# Altium project eTraceConcrete_V1_1.PrjPcb (part 3 of 7)

## Sheet ATSAMD21G18A.SchDoc
size A2
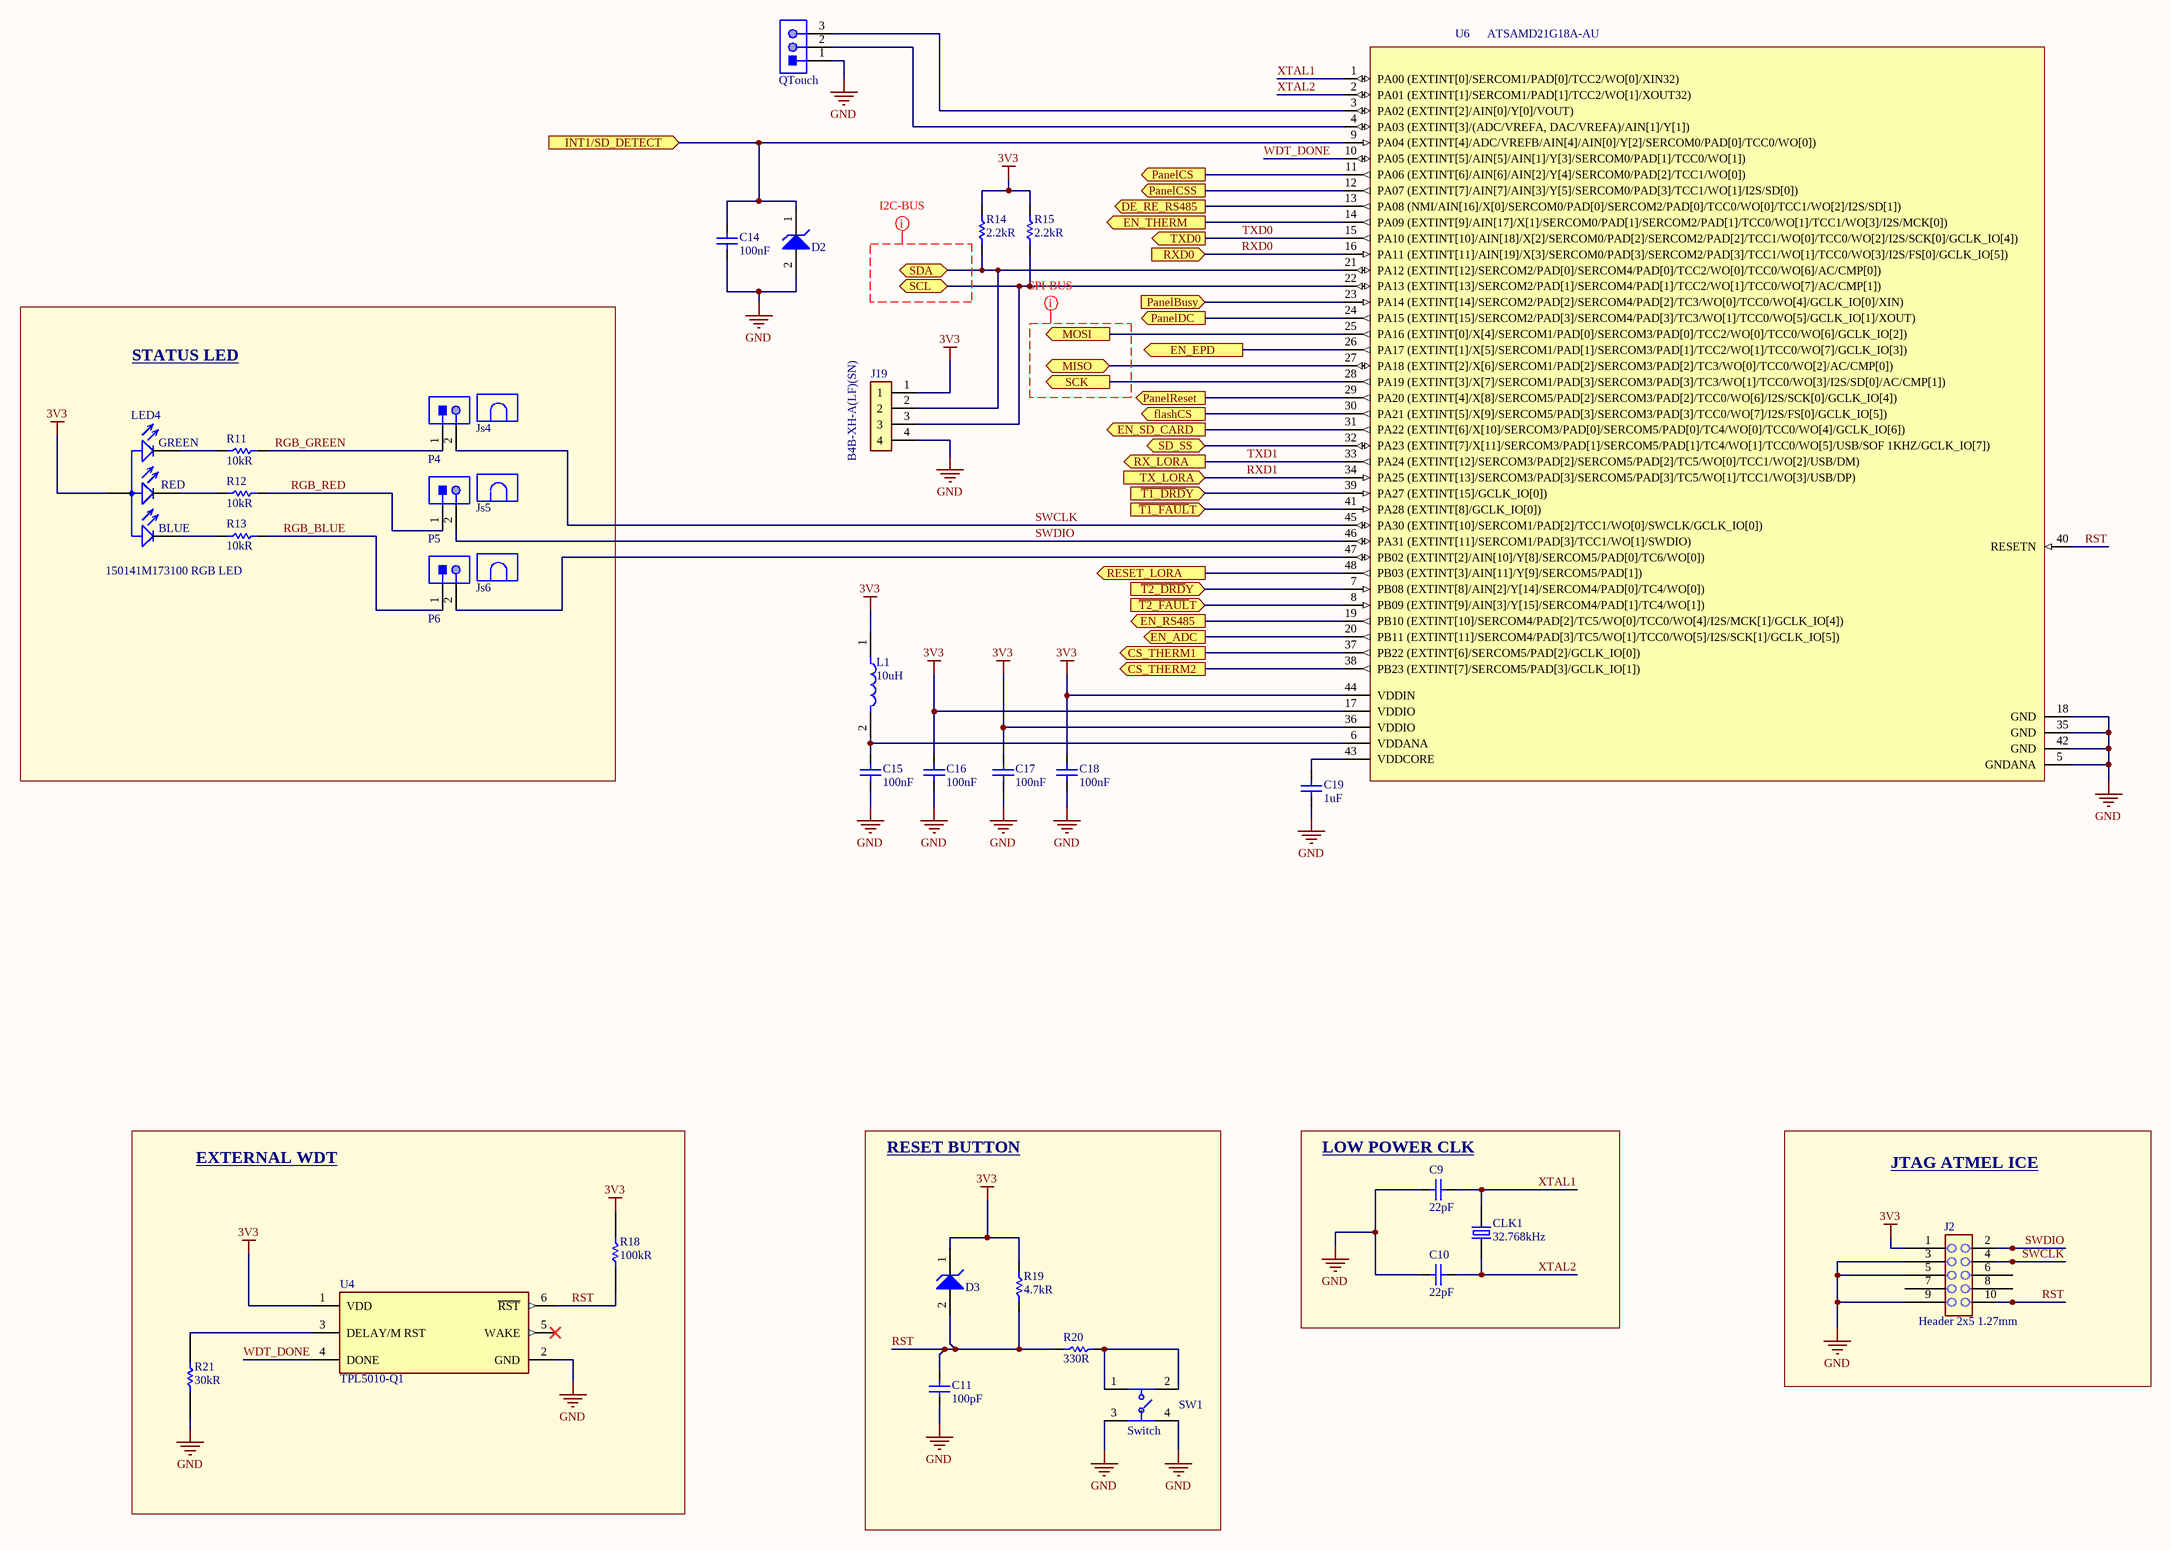
[diagram p3: ATSAMD21G18A.SchDoc]

### Parts
C9  22pF  [Cap 0805 (2012 Metric)]
C10  22pF  [Cap 0805 (2012 Metric)]
C11  100pF  [Cap 0805 (2012 Metric)]
C14  100nF  [Cap 0805 (2012 Metric)]
C15  100nF  [Cap 0805 (2012 Metric)]
C16  100nF  [Cap 0805 (2012 Metric)]
C17  100nF  [Cap 0805 (2012 Metric)]
C18  100nF  [Cap 0805 (2012 Metric)]
C19  1uF  [Cap 0805 (2012 Metric)]
CLK1  Frequency: 32.768kHz  [ECS-327-12.5-13X]  (hidden comment: ECS-327-12.5-13X)
D2  Diode  [Diode SOD123]  (value not drawn)
D3  Diode  [Diode SOD123]  (value not drawn)
J2  Header 2x5 1.27mm  [HEADER_2X5_1-27mm_NO_CONNECTOR]
J19  B4B-XH-A(LF)(SN)  [B4B-XH-A(LF)(SN)]
Js4  Jumper (2x1)  [Header JMP 2x1]  (value not drawn)
Js5  Jumper (2x1)  [Header JMP 2x1]  (value not drawn)
Js6  Jumper (2x1)  [Header JMP 2x1]  (value not drawn)
L1  10uH  [Ind 0805 (2012 METRIC)]
LED4  150141M173100 RGB LED  [150141M173100]
P4  Header 2x1  [Header 2x1]  (value not drawn)
P5  Header 2x1  [Header 2x1]  (value not drawn)
P6  Header 2x1  [Header 2x1]  (value not drawn)
QTouch  Header 3x1  [HEADER 3X1]  (value not drawn)
R11  10kR  [Res 0805 (2012 Metric)]
R12  10kR  [Res 0805 (2012 Metric)]
R13  10kR  [Res 0805 (2012 Metric)]
R14  2.2kR  [Res 0805 (2012 Metric)]
R15  2.2kR  [Res 0805 (2012 Metric)]
R18  100kR  [Res 0805 (2012 Metric)]
R19  4.7kR  [Res 0805 (2012 Metric)]
R20  330R  [Res 0805 (2012 Metric)]
R21  30kR  [Res 0805 (2012 Metric)]
SW1  Switch  [Sw 4 (4.5 X 4.5mm)]
U4  TPL5010-Q1  [TPL5010-Q1_IPCA]
U6  ATSAMD21G18A-AU-ND  [ATSAMD21G18A-AU-ND]  (value not drawn)

### Blocks framed on the sheet
STATUS LED: Js4-Js6 LED4 P4-P6 R11-R13
EXTERNAL WDT: R18 R21 U4
RESET BUTTON: C11 D3 R19 R20 SW1
LOW POWER CLK: C9 C10 CLK1
JTAG ATMEL ICE: J2

### Ports
CS_THERM1 (out), CS_THERM2 (out), DE_RE_RS485 (out), EN_ADC (out), EN_EPD (out), EN_RS485 (out), EN_SD_CARD (out), EN_THERM (out), flashCS (out), INT1/SD_DETECT (in), MISO (bidir), MOSI (out), PanelBusy (in), PanelCS (out), PanelCSS (out), PanelDC (out), PanelReset (out), RESET_LORA (out), RX_LORA (out), RXD0 (in), SCK (out), SCL (bidir), SD_SS (bidir), SDA (bidir), TX_LORA (in), TXD0 (out), ~{T1_DRD}Y (in), ~{T1_FAUL}T (in), ~{T2_DRD}Y (in), ~{T2_FAUL}T (in)

### Nets
3V3: C16.1 C17.1 C18.1 D3.1(K) J2.1 J19.1 L1.1 LED4.1(A) R14.1 R15.1 R18.1 R19.1 U4.1(VDD) U6.17(VDDIO) U6.36(VDDIO) U6.44(VDDIN)
GND: C9.1 C10.1 C11.2 C14.2 C15.2 C16.2 C17.2 C18.2 C19.2 D2.2(A) J2.3 J2.5 J2.9 J19.4 QTouch.1 R21.2 SW1.3 SW1.4 U4.2(GND) U6.5(GNDANA) U6.18(GND) U6.35(GND) U6.42(GND)  [project net BS]
~{T1_DRD}Y: U6.39(PA27_(EXTINT[15]/GCLK_IO[0])) ; port ~{T1_DRD}Y
~{T1_FAUL}T: U6.41(PA28_(EXTINT[8]/GCLK_IO[0])) ; port ~{T1_FAUL}T
~{T2_DRD}Y: U6.7(PB08_(EXTINT[8]/AIN[2]/Y[14]/SERCOM4/PAD[0]/TC4/WO[0])) ; port ~{T2_DRD}Y
~{T2_FAUL}T: U6.8(PB09_(EXTINT[9]/AIN[3]/Y[15]/SERCOM4/PAD[1]/TC4/WO[1])) ; port ~{T2_FAUL}T
BUSY_COG: U6.23(PA14_(EXTINT[14]/SERCOM2/PAD[2]/SERCOM4/PAD[2]/TC3/WO[0]/TCC0/WO[4]/GCLK_IO[0]/XIN)) ; port PanelBusy
CS_THERM1: U6.37(PB22_(EXTINT[6]/SERCOM5/PAD[2]/GCLK_IO[0])) ; port CS_THERM1
CS_THERM2: U6.38(PB23_(EXTINT[7]/SERCOM5/PAD[3]/GCLK_IO[1])) ; port CS_THERM2
D/C_COG: U6.24(PA15_(EXTINT[15]/SERCOM2/PAD[3]/SERCOM4/PAD[3]/TC3/WO[1]/TCC0/WO[5]/GCLK_IO[1]/XOUT)) ; port PanelDC
DE_RE_RS485: U6.13(PA08_(NMI/AIN[16]/X[0]/SERCOM0/PAD[0]/SERCOM2/PAD[0]/TCC0/WO[0]/TCC1/WO[2]/I2S/SD[1])) ; port DE_RE_RS485
EN_ADC: U6.20(PB11_(EXTINT[11]/SERCOM4/PAD[3]/TC5/WO[1]/TCC0/WO[5]/I2S/SCK[1]/GCLK_IO[5])) ; port EN_ADC
EN_EPD: U6.26(PA17_(EXTINT[1]/X[5]/SERCOM1/PAD[1]/SERCOM3/PAD[1]/TCC2/WO[1]/TCC0/WO[7]/GCLK_IO[3])) ; port EN_EPD
EN_RS485: U6.19(PB10_(EXTINT[10]/SERCOM4/PAD[2]/TC5/WO[0]/TCC0/WO[4]/I2S/MCK[1]/GCLK_IO[4])) ; port EN_RS485
EN_SD_CARD: U6.31(PA22_(EXTINT[6]/X[10]/SERCOM3/PAD[0]/SERCOM5/PAD[0]/TC4/WO[0]/TCC0/WO[4]/GCLK_IO[6])) ; port EN_SD_CARD
EN_THERM: U6.14(PA09_(EXTINT[9]/AIN[17]/X[1]/SERCOM0/PAD[1]/SERCOM2/PAD[1]/TCC0/WO[1]/TCC1/WO[3]/I2S/MCK[0])) ; port EN_THERM
EPD_CS_M_COG_COG: U6.11(PA06_(EXTINT[6]/AIN[6]/AIN[2]/Y[4]/SERCOM0/PAD[2]/TCC1/WO[0])) ; port PanelCS
EPD_CS_S_COG: U6.12(PA07_(EXTINT[7]/AIN[7]/AIN[3]/Y[5]/SERCOM0/PAD[3]/TCC1/WO[1]/I2S/SD[0])) ; port PanelCSS
flashCS: U6.30(PA21_(EXTINT[5]/X[9]/SERCOM5/PAD[3]/SERCOM3/PAD[3]/TCC0/WO[7]/I2S/FS[0]/GCLK_IO[5])) ; port flashCS
INT1/SD_DETECT: C14.1 D2.1(K) U6.9(PA04_(EXTINT[4]/ADC/VREFB/AIN[4]/AIN[0]/Y[2]/SERCOM0/PAD[0]/TCC0/WO[0])) ; port INT1/SD_DETECT
MISO: U6.27(PA18_(EXTINT[2]/X[6]/SERCOM1/PAD[2]/SERCOM3/PAD[2]/TC3/WO[0]/TCC0/WO[2]/AC/CMP[0])) ; port MISO
MOSI: U6.25(PA16_(EXTINT[0]/X[4]/SERCOM1/PAD[0]/SERCOM3/PAD[0]/TCC2/WO[0]/TCC0/WO[6]/GCLK_IO[2])) ; port MOSI
PanelReset: U6.29(PA20_(EXTINT[4]/X[8]/SERCOM5/PAD[2]/SERCOM3/PAD[2]/TCC0/WO[6]/I2S/SCK[0]/GCLK_IO[4])) ; port PanelReset
RESET_LORA: U6.48(PB03_(EXTINT[3]/AIN[11]/Y[9]/SERCOM5/PAD[1])) ; port RESET_LORA
RGB_BLUE: P6.1 R13.2
RGB_GREEN: P4.1 R11.2
RGB_RED: P5.1 R12.2
RST: C11.1 D3.2(A) J2.10 R18.2 R19.2 R20.1 U4.6(~{RST}) U6.40(RESETN)
RXD0: U6.16(PA11_(EXTINT[11]/AIN[19]/X[3]/SERCOM0/PAD[3]/SERCOM2/PAD[3]/TCC1/WO[1]/TCC0/WO[3]/I2S/FS[0]/GCLK_IO[5])) ; port RXD0
RXD1: U6.34(PA25_(EXTINT[13]/SERCOM3/PAD[3]/SERCOM5/PAD[3]/TC5/WO[1]/TCC1/WO[3]/USB/DP)) ; port TX_LORA
SCK: U6.28(PA19_(EXTINT[3]/X[7]/SERCOM1/PAD[3]/SERCOM3/PAD[3]/TC3/WO[1]/TCC0/WO[3]/I2S/SD[0]/AC/CMP[1])) ; port SCK
SCL: J19.3 R15.2 U6.22(PA13_(EXTINT[13]/SERCOM2/PAD[1]/SERCOM4/PAD[1]/TCC2/WO[1]/TCC0/WO[7]/AC/CMP[1])) ; port SCL
SD_SS: U6.32(PA23_(EXTINT[7]/X[11]/SERCOM3/PAD[1]/SERCOM5/PAD[1]/TC4/WO[1]/TCC0/WO[5]/USB/SOF_1KHZ/GCLK_IO[7])) ; port SD_SS
SDA: J19.2 R14.2 U6.21(PA12_(EXTINT[12]/SERCOM2/PAD[0]/SERCOM4/PAD[0]/TCC2/WO[0]/TCC0/WO[6]/AC/CMP[0])) ; port SDA
SWCLK: J2.4 P4.2 U6.45(PA30_(EXTINT[10]/SERCOM1/PAD[2]/TCC1/WO[0]/SWCLK/GCLK_IO[0]))
SWDIO: J2.2 P5.2 U6.46(PA31_(EXTINT[11]/SERCOM1/PAD[3]/TCC1/WO[1]/SWDIO))
TXD0: U6.15(PA10_(EXTINT[10]/AIN[18]/X[2]/SERCOM0/PAD[2]/SERCOM2/PAD[2]/TCC1/WO[0]/TCC0/WO[2]/I2S/SCK[0]/GCLK_IO[4])) ; port TXD0
TXD1: U6.33(PA24_(EXTINT[12]/SERCOM3/PAD[2]/SERCOM5/PAD[2]/TC5/WO[0]/TCC1/WO[2]/USB/DM)) ; port RX_LORA  [project net RX_LORA]
WDT_DONE: U4.4(DONE) U6.10(PA05_(EXTINT[5]/AIN[5]/AIN[1]/Y[3]/SERCOM0/PAD[1]/TCC0/WO[1]))
XTAL1: C9.2 CLK1.2 U6.1(PA00_(EXTINT[0]/SERCOM1/PAD[0]/TCC2/WO[0]/XIN32))
XTAL2: C10.2 CLK1.1 U6.2(PA01_(EXTINT[1]/SERCOM1/PAD[1]/TCC2/WO[1]/XOUT32))
NetC15_1: C15.1 L1.2 U6.6(VDDANA)
NetC19_1: C19.1 U6.43(VDDCORE)
NetLED4_2: LED4.2(B_C) R13.1
NetLED4_3: LED4.3(R_C) R12.1
NetLED4_4: LED4.4(G_C) R11.1
NetP6_2: P6.2 U6.47(PB02_(EXTINT[2]/AIN[10]/Y[8]/SERCOM5/PAD[0]/TC6/WO[0]))
NetQTouch_2: QTouch.2 U6.4(PA03_(EXTINT[3]/(ADC/VREFA,_DAC/VREFA)/AIN[1]/Y[1]))
NetQTouch_3: QTouch.3 U6.3(PA02_(EXTINT[2]/AIN[0]/Y[0]/VOUT))
NetR20_2: R20.2 SW1.1 SW1.2
NetR21_1: R21.1 U4.3(DELAY/M_RST)

Not connected (* = marked no-connect by the designer): J2 6 7 8; U4 5(WAKE)*

### Layout directives
net class I2C-BUS: (no net found under the mark)
net class SPI-BUS: (no net found under the mark)

### Notes on the sheet
- (in symbol 150141M173100) GREEN; RED; BLUE

### Library data of the parts
C9 C10 = Capacitor: Capacitor; Ceramic; Cap; 22.0pF; Tol 5%; SMT; Vol-Rtg 50V; C0G; Tape and Reel; Manufacturer: KEMET; Manufacturer Part Number: C0805C220J5GACTU; Temperature Coefficient: 30ppm/°C; Link: https://www.digikey.com/es/products/detail/kemet/C0805C220J5GACTU/411112?s=N4IgTCBcDaIMIAYAcCCscxgQKVQcQEE4AVAVRAF0BfIA; Supplier 1: Digi-Key; Supplier Part Number 1: 399-1113-1-ND; RoHS: Yes; Category: Ceramic Capacitors; Stock 1: 71297; Pricing 1: 1=0,10000, 10=0,06300, 50=0,03440, 100=0,02820, 500=0,02012, 1000=0,01581 (USD); Mount: PCB,Surface Mount; Case/Package: 0805; Case Code (Metric): 2012; Case Code (Imperial): 0805; Weight: 0.000194oz; Contact Material: Tin; Contact Plating: Tin,Matte; Dielectric Material: Ceramic; Min Operating Temperature: -55°C; Max Operating Temperature: 125°C; Packaging: Tape and Reel; Capacitance: 22pF; Tolerance: 5%; Package Quantity: 1; Voltage Rating: 50V; Voltage Rating (DC): 50V; Dielectric: C0G; Termination: SMD/SMT; Voltage: 50V; Series: C0805C; Construction: Flat; Length: 2mm; Width: 1.25mm; Height: 0.78mm; Thickness: 0.035inch; Depth: 1.25mm; Radiation Hardening: No; REACH SVHC: No SVHC; Lead Free: Lead Free; ComponentLink1URL: https://datasheet.ciiva.com/7842/1732694-7842250.pdf?src-supplier=Element14; ComponentLink1Description: https://datasheet.ciiva.com/7842/1732694-7842250.pdf?src-supplier=Element14; ComponentLink2URL: https://datasheet.ciiva.com/7842/1372242-7842570.pdf?src-supplier=Element14; ComponentLink2Description: https://datasheet.ciiva.com/7842/1372242-7842570.pdf?src-supplier=Element14; ComponentLink3URL: https://datasheet.ciiva.com/7842/1732694-7842251.pdf?src-supplier=Element14; ComponentLink3Description: https://datasheet.ciiva.com/7842/1732694-7842251.pdf?src-supplier=Element14; ComponentLink4URL: https://datasheet.ciiva.com/7842/kem-c1003-c0g-smd-7842569.pdf?src-supplier=Element14; ComponentLink4Description: https://datasheet.ciiva.com/7842/kem-c1003-c0g-smd-7842569.pdf?src-supplier=Element14; ComponentLink5URL: https://datasheet.ciiva.com/28668/1789732-28668761.pdf?src-supplier=Element14; ComponentLink5Description: https://datasheet.ciiva.com/28668/1789732-28668761.pdf?src-supplier=Element14
C11 = Capacitor: KEMET - C0805C101J5GACTU - Keramikvielschichtkondensator, SMD, 100 pF, 50 V, 0805 [Metrisch 2012], ± 5%, C0G / NP0; Dielectric Material: Ceramic; Voltage Rating: 50V; Temperature Coefficient: 30ppm/°C; Dissipation Factor: 0.1%; Link: https://www.digikey.com/es/products/detail/kemet/C0805C101J5GACTU/411121?s=N4IgTCBcDaIMIAYAcCCscCMCMClUHEBBOAFQFUQBdAXyA; Supplier 1: Digi-Key; Supplier Part Number 1: 399-1122-1-ND; Manufacturer: KEMET; Manufacturer Part Number: C0805C101J5GACTU; RoHS: Yes; Category: Ceramic Capacitors; Stock 1: 245739; Pricing 1: 1=0,10000, 10=0,06100, 50=0,03320, 100=0,02700, 500=0,01932, 1000=0,01518 (USD); Mount: Surface Mount,PCB; Case/Package: 0805; Number of Pins: 2; Case Code (Imperial): 0805; Case Code (Metric): 2012; Contact Material: Tin; Contact Plating: Tin,Matte; Min Operating Temperature: -55°C; Max Operating Temperature: 125°C; Capacitance: 100pF; Tolerance: 5%; Voltage Rating (DC): 50V; Packaging: Tape and Reel; Package Quantity: 4000; Dielectric: C0G; Termination: SMD/SMT; Voltage: 50V; Series: C; Construction: Flat; Length: 2mm; Width: 1.2mm; Height: 0.78mm; Lead Pitch: 0.75mm; Depth: 1.25mm; Thickness: 0.035inch; Radiation Hardening: No; Lead Free: Lead Free; REACH SVHC: No SVHC; RoHS Compliant: Yes; ComponentLink1URL: https://datasheet.ciiva.com/148/kem-c1003-c0g-smd-148288.pdf?src-supplier=Avnet; ComponentLink1Description: https://datasheet.ciiva.com/148/kem-c1003-c0g-smd-148288.pdf?src-supplier=Avnet; ComponentLink2URL: https://datasheet.ciiva.com/6126/1732691-6126304.pdf?src-supplier=Farnell; ComponentLink2Description: https://datasheet.ciiva.com/6126/1732691-6126304.pdf?src-supplier=Farnell; ComponentLink3URL: https://datasheet.ciiva.com/144/docfinderpartnumber-c0805c101j5gactu-144460.pdf?src-supplier=Digi-Key; ComponentLink3Description: https://datasheet.ciiva.com/144/docfinderpartnumber-c0805c101j5gactu-144460.pdf?src-supplier=Digi-Key; ComponentLink4URL: https://datasheet.ciiva.com/7405/1668702-7405226.pdf?src-supplier=Newark; ComponentLink4Description: https://datasheet.ciiva.com/7405/1668702-7405226.pdf?src-supplier=Newark; ComponentLink5URL: https://datasheet.ciiva.com/7842/1732691-7842149.pdf?src-supplier=Element14; ComponentLink5Description: https://datasheet.ciiva.com/7842/1732691-7842149.pdf?src-supplier=Element14; ComponentLink6URL: https://datasheet.ciiva.com/28688/1789732-28688665.pdf?src-supplier=Element14; ComponentLink6Description: https://datasheet.ciiva.com/28688/1789732-28688665.pdf?src-supplier=Element14; ComponentLink7URL: https://datasheet.ciiva.com/11463/kem-c1003-c0g-smd-11463525.pdf?src-supplier=Avnet; ComponentLink7Description: https://datasheet.ciiva.com/11463/kem-c1003-c0g-smd-11463525.pdf?src-supplier=Avnet; ComponentLink8URL: https://datasheet.ciiva.com/18193/getdatasheetpartid-385628-18193291.pdf?src-supplier=Verical; ComponentLink8Description: https://datasheet.ciiva.com/18193/getdatasheetpartid-385628-18193291.pdf?src-supplier=Verical
C14-C18 = Capacitor: YAGEO (PHYCOMP)         CC0805ZRY5V9BB104             SMD Multilayer Ceramic Capacitor, 0805 [2012 Metric], 0.1 uF, 50 V, +80%, -20%, Y5V, CC Series; Tolerance: 80%; Voltage Rating: 50V; Link: https://www.digikey.com/es/products/detail/yageo/CC0805ZRY5V9BB104/2103099?s=N4IgTCBcDaIMJwAwA5EFYBaAlAmmgagJwBCxAjIgCwgC6AvkA; Supplier 1: Digi-Key; Supplier Part Number 1: 311-1361-1-ND; Manufacturer: Yageo; Manufacturer Part Number: CC0805ZRY5V9BB104; RoHS: Yes; Category: Ceramic Capacitors; Stock 1: 92689; Pricing 1: 1=0,10000, 10=0,07000, 50=0,03800, 100=0,03100, 500=0,02214, 1000=0,01739 (USD); Mount: Surface Mount; Case/Package: 0805; Number of Pins: 2; Case Code (Metric): 2012; Case Code (Imperial): 0805; Material: Ceramic; Dielectric Material: Ceramic; Min Operating Temperature: -30°C; Max Operating Temperature: 85°C; Capacitance: 100nF; Dielectric: Y5V; Package Quantity: 1; Packaging: Tape and Reel; Voltage Rating (DC): 50V; Termination: SMD/SMT; Resistor Type: Ceramic; Series: CC; Construction: Flat; Length: 2mm; Width: 0.049inch; Height: 0.6mm; Depth: 1.25mm; Thickness: 0.024inch; Radiation Hardening: No; REACH SVHC: No SVHC; Lead Free: Lead Free; Halogen Free: Halogen Free; RoHS Compliant: Yes; ComponentLink1URL: https://datasheet.ciiva.com/144/mlccorderingcode-144209.pdf?src-supplier=Digi-Key; ComponentLink1Description: https://datasheet.ciiva.com/144/mlccorderingcode-144209.pdf?src-supplier=Digi-Key; ComponentLink2URL: https://datasheet.ciiva.com/144/mlccorderingcode-144210.pdf?src-supplier=Digi-Key; ComponentLink2Description: https://datasheet.ciiva.com/144/mlccorderingcode-144210.pdf?src-supplier=Digi-Key; ComponentLink3URL: https://datasheet.ciiva.com/144/mlccorderingcode-144211.pdf?src-supplier=Digi-Key; ComponentLink3Description: https://datasheet.ciiva.com/144/mlccorderingcode-144211.pdf?src-supplier=Digi-Key; ComponentLink4URL: https://datasheet.ciiva.com/11465/upy-gphc-y5v-6-3v-to-50v-5-11465865.pdf?src-supplier=Avnet; ComponentLink4Description: https://datasheet.ciiva.com/11465/upy-gphc-y5v-6-3v-to-50v-5-11465865.pdf?src-supplier=Avnet; ComponentLink5URL: https://datasheet.ciiva.com/13389/upy-gp-np0-16v-to-50v-8-13389351.pdf?src-supplier=Mouser; ComponentLink5Description: https://datasheet.ciiva.com/13389/upy-gp-np0-16v-to-50v-8-13389351.pdf?src-supplier=Mouser; ComponentLink6URL: https://datasheet.ciiva.com/17435/upy-gphc-y5v-6-3v-to-50v-5-17435053.pdf?src-supplier=Avnet+Europe; ComponentLink6Description: https://datasheet.ciiva.com/17435/upy-gphc-y5v-6-3v-to-50v-5-17435053.pdf?src-supplier=Avnet+Europe; ComponentLink7URL: https://datasheet.ciiva.com/15189/getdatasheetpartid-55882-15189238.pdf?src-supplier=Verical; ComponentLink7Description: https://datasheet.ciiva.com/15189/getdatasheetpartid-55882-15189238.pdf?src-supplier=Verical; ComponentLink8URL: https://datasheet.ciiva.com/16747/upy-gphc-y5v-6-3v-to-50v-5-revised-16747323.pdf?src-supplier=Future+Electronics; ComponentLink8Description: https://datasheet.ciiva.com/16747/upy-gphc-y5v-6-3v-to-50v-5-revised-16747323.pdf?src-supplier=Future+Electronics; ComponentLink9URL: https://datasheet.ciiva.com/28450/1132289-28450870.pdf?src-supplier=Element14; ComponentLink9Description: https://datasheet.ciiva.com/28450/1132289-28450870.pdf?src-supplier=Element14; ComponentLink10URL: https://datasheet.ciiva.com/29241/445331-da-01-en-kerko-chip-0805-y5v0-1uf-20-80proz50vg-29241946.pdf?src-supplier=Conrad; ComponentLink10Description: https://datasheet.ciiva.com/29241/445331-da-01-en-kerko-chip-0805-y5v0-1uf-20-80proz50vg-29241946.pdf?src-supplier=Conrad
C19 = Capacitor: Ceramic capacitor SMD-0805 1000nF /16V X7R# K +-10%, Samsung, RoHS/3000pcs/; Manufacturer Part Number: CL21B105KOFNNNG; Voltage Rating: 16V; Tolerance: 10%; Dielectric: X7R; Link: https://www.digikey.com/es/products/detail/samsung-electro-mechanics/CL21B105KOFNNNG/3894469?s=N4IgTCBcDaIMIBkwEYBCyAMBWA0geQDEA5EgcRAF0BfIA; Supplier 1: Digi-Key; Supplier Part Number 1: 1276-6471-1-ND; Manufacturer: Samsung; RoHS: Yes; Category: Ceramic Capacitors; Stock 1: 36000; Pricing 1: 1=0,10000, 10=0,05700, 50=0,03120, 100=0,02540, 500=0,01816, 1000=0,01426 (USD); Mount: Surface Mount; Case/Package: 0805; Case Code (Metric): 2012; Case Code (Imperial): 0805; Material: Ceramic; Min Operating Temperature: -55°C; Max Operating Temperature: 125°C; Package Quantity: 3000; Packaging: Tape and Reel; Capacitance: 1uF; Voltage: 16V; Series: CL; Length: 2mm; Width: 0.049inch; Height: 1.25mm; Thickness: 0.053inch; Depth: 1.25mm; Lead Free: Lead Free; ComponentLink1URL: https://datasheet.ciiva.com/25733/cl21b105kofnnng-25733281.pdf?src-supplier=Digi-Key; ComponentLink1Description: https://datasheet.ciiva.com/25733/cl21b105kofnnng-25733281.pdf?src-supplier=Digi-Key; ComponentLink2URL: https://datasheet.ciiva.com/29199/455935-da-01-en-vs-kondensator-0805-29199047.pdf?src-supplier=Conrad; ComponentLink2Description: https://datasheet.ciiva.com/29199/455935-da-01-en-vs-kondensator-0805-29199047.pdf?src-supplier=Conrad; ComponentLink3URL: https://datasheet.ciiva.com/16428/cl05b104kq5nnnc-16428885.pdf?src-supplier=Future+Electronics; ComponentLink3Description: https://datasheet.ciiva.com/16428/cl05b104kq5nnnc-16428885.pdf?src-supplier=Future+Electronics; ComponentLink4URL: https://datasheet.ciiva.com/26310/mlcc-catalogdownload2013-eng-26310156.pdf?src-supplier=Distrelec; ComponentLink4Description: https://datasheet.ciiva.com/26310/mlcc-catalogdownload2013-eng-26310156.pdf?src-supplier=Distrelec
CLK1 = ECS-327-12.5-13X: CRYSTAL 32.7680KHZ 12.5PF T/H; Manufacturer: ECS International; Manufacturer Part Number: ECS-.327-12.5-13X; Tolerance: 20ppm; ESR (Equivalent Series Resistance): 35kR; Supplier 1: Digi-Key; Stock 1: 22593; Pricing 1: 1=0.24, 10=0.2, 50=0.1798, 100=0.1599, 500=0.15186, 1000=0.12789, 2500=0.1199, 5000=0.1159, 10000=0.1119 (USD); Mount: Through Hole; Case/Package: Radial; Min Operating Temperature: -10°C; Max Operating Temperature: 60°C; Load Capacitance: 12.5pF; Package Quantity: 1000; Frequency Tolerance: 20ppm; Packaging: Bulk; Termination: Radial; Length: 0.244inch; Height: 0.244inch; Lead Free: Lead Free; ComponentLink1URL: http://www.mouser.com/ds/2/122/ECS-3x8X%202x6X%201X5X-5572.pdf?src-supplier=Mouser; ComponentLink1Description: http://www.mouser.com/ds/2/122/ECS-3x8X%202x6X%201X5X-5572.pdf?src-supplier=Mouser; Supplier Part Number 1: X1124-ND; Link: https://www.digikey.com/es/products/detail/ecs-inc/ECS-327-12-5-13X/827615
D2 D3 = Diode: DIODE GEN PURP 75V 150MA 0603; Manufacturer: Taiwan Semiconductor; Manufacturer Part Number: TS4148CRZG; Forward Voltage: 1.25V; Peak Non-Repetitive Surge Current: 800mA; Element Configuration: Single; Max Forward Surge Current (Ifsm): 2A; Reverse Recovery Time: 4ns; Link: https://www.digikey.com/es/products/detail/taiwan-semiconductor-corporation/TS4148C-RZG/7359811?s=N4IgTCBcDaICoGUAsBGJAOAwgJQFoHEQBdAXyA; Supplier 1: Digi-Key; Supplier Part Number 1: TS4148CRZGCT-ND; RoHS: Yes; Category: Uncategorized; Stock 1: 278970; Pricing 1: 1=0,39000, 10=0,29400, 100=0,16640, 500=0,11022, 1000=0,08450, 2000=0,07348 (USD); Mount: Surface Mount; Case/Package: SMD/SMT; Number of Pins: 2; Min Operating Temperature: -55°C; Max Operating Temperature: 150°C; Packaging: Tape and Reel; Package Quantity: 5000; Max Repetitive Reverse Voltage (Vrrm): 75V; Radiation Hardening: No; RoHS Compliant: Yes; ComponentLink1URL: https://datasheet.ciiva.com/18168/getdatasheetpartid-464901-18168310.pdf?src-supplier=Verical; ComponentLink1Description: https://datasheet.ciiva.com/18168/getdatasheetpartid-464901-18168310.pdf?src-supplier=Verical
J2 = Header 2x5 1.27mm: Connector Header Through Hole 10 position 0.050" (1.27mm); Manufacturer: Adam Equipment; Manufacturer Part Number: HPH2-A-10-UA; Supplier 1: Digi-Key; RoHS: No; Category: Headers and Wire Housings; Stock 1: 750; Pricing 1: 1=0,62000, 10=0,58300, 100=0,44720, 500=0,38886, 1000=0,32081, 5000=0,28192, 10000=0,26248 (USD); Link: https://www.digikey.com/product-detail/en/adam-tech/HPH2-A-10-UA/2057-HPH2-A-10-UA-ND/9831103; Supplier Part Number 1: 2057-HPH2-A-10-UA-ND
J19 = B4B-XH-A(LF)(SN): JST (JAPAN SOLDERLESS TERMINALS) - B4B-XH-A (LF)(SN) - Wire-To-Board Connector, Vertical, 2.5 mm, 4 Contacts, Header, XH Series, Through Hole, 1 Rows; Insulation Resistance: 1GR; Current Rating: 3A; Contact Resistance: 20mR; Gender: Male; Number of Positions: 4; Max Voltage Rating (AC): 250V; Connector Type: Male Pin; Pitch: 2.5mm; Wire/Cable Gauge: 22AWG; Supplier 1: Arrow Electronics; Manufacturer: JST; RoHS: Yes; Category: FFC / FPC; Mount: Through Hole; Contact Plating: Tin,Copper,Lead; Contact Material: Brass; Color: Natural; Housing Material: Polyamide; Housing Color: White; Material: Polyamide; Min Operating Temperature: -25°C; Max Operating Temperature: 85°C; Termination: Press-Fit; Series: XH; Number of Rows: 1; Packaging: Bulk; Orientation: Straight; Max Current Rating: 3A; Package Quantity: 500; Number of Contacts: 4; Contact Type: Male Pin; Voltage Rating (AC): 250V; Voltage Rating: 250V; Max Voltage Rating (DC): 250V; Length: 12.4mm; Depth: 5.75mm; Lead Pitch: 2.5mm; REACH SVHC: No SVHC; Lead Free: Lead Free; ComponentLink1URL: https://datasheet.ciiva.com/26894/getdatasheetpartid-455616-26894787.pdf?src-supplier=Verical; ComponentLink1Description: https://datasheet.ciiva.com/26894/getdatasheetpartid-455616-26894787.pdf?src-supplier=Verical; ComponentLink2URL: https://datasheet.ciiva.com/16203/b4b-xh-alfsn-16203642.pdf?src-supplier=Future+Electronics; ComponentLink2Description: https://datasheet.ciiva.com/16203/b4b-xh-alfsn-16203642.pdf?src-supplier=Future+Electronics; ComponentLink3URL: https://datasheet.ciiva.com/26924/getdatasheetpartid-640571-26924035.pdf?src-supplier=Verical; ComponentLink3Description: https://datasheet.ciiva.com/26924/getdatasheetpartid-640571-26924035.pdf?src-supplier=Verical; ComponentLink4URL: https://datasheet.ciiva.com/726/exh-726404.pdf?src-supplier=Digi-Key; ComponentLink4Description: https://datasheet.ciiva.com/726/exh-726404.pdf?src-supplier=Digi-Key; Manufacturer Part Number: B4B-XH-A(LF)(SN); Supplier Part Number 1: B4B-XH-A (LF)(SN); Link: https://www.digikey.com/es/products/detail/jst-sales-america-inc/B4B-XH-A-LF-SN/1651047?s=N4IgTCBcDaIEIBY4FoAaAJZBBAFAGQDEBKHAZQDkiQBdAXyA
Js4-Js6 = Jumper (2x1): 2 (1 x 2) Position Shunt Connector Black Open Top 0.100" (2.54mm) Gold; Manufacturer: Sullins; Manufacturer Part Number: QPC02SXGN-RC; Number of Positions: 2; Pitch: 0.1inch; Link: https://www.digikey.com/product-detail/en/sullins-connector-solutions/QPC02SXGN-RC/S9337-ND/2618262; Supplier 1: Digi-Key; Supplier Part Number 1: S9337-ND; RoHS: Yes; Category: Connectors; Stock 1: 529611; Pricing 1: 1=0,10000, 10=0,05900, 25=0,04400, 50=0,03780, 100=0,03650, 250=0,03152, 500=0,03024, 1000=0,02646, 2500=0,02394 (USD); Case/Package: 100; Contact Plating: Gold; Package Quantity: 2000; Packaging: Bulk; Height: 0.235inch; Lead Free: Lead Free; ComponentLink1URL: https://datasheet.ciiva.com/767/284-sxgn-11510-767869.pdf?src-supplier=Digi-Key; ComponentLink1Description: https://datasheet.ciiva.com/767/284-sxgn-11510-767869.pdf?src-supplier=Digi-Key
L1 = Inductor: TDK - MLZ2012M100WT000 - High Frequency Inductor, 10 µH, MLZ Series, 350 mA, 0805 [2012 Metric], Multilayer, 0.47 ohm; Core Material: Ferrite; Tolerance: 20%; Shielding: Shielded; DC Resistance (DCR): 611mR; Self Resonant Frequency: 50MHz; Test Frequency: 2MHz; Current Rating: 350mA; Saturation Current: 200mA; Link: https://www.digikey.com/es/products/detail/tdk-corporation/MLZ2012M100WT000/2465153?s=N4IgTCBcDaILIBkBaYAMBGMd2tQdQBVdUQBdAXyA; Supplier 1: Avnet; Supplier Part Number 1: 05X0436; Manufacturer: TDK; Manufacturer Part Number: MLZ2012M100WT000; RoHS: Yes; Category: Fixed Inductors; Stock 1: 4; Pricing 1: 1=0,13000, 10=0,09800, 25=0,09500, 50=0,09100, 100=0,08800, 250=0,08200, 500=0,07600 (USD); Mount: Surface Mount; Case/Package: 0805; Case Code (Metric): 2012; Case Code (Imperial): 0805; Min Operating Temperature: -55°C; Max Operating Temperature: 125°C; Packaging: Tape and Reel; Inductance: 10uH; Package Quantity: 1; Length: 0.079inch; Width: 0.049inch; Height - Seated (Max): 0.057inch; Lead Free: Lead Free; ComponentLink1URL: https://datasheet.ciiva.com/29699/inductor-commercial-decoupling-mlz-en-29699061.pdf?src-supplier=Digi-Key; ComponentLink1Description: https://datasheet.ciiva.com/29699/inductor-commercial-decoupling-mlz-en-29699061.pdf?src-supplier=Digi-Key; ComponentLink2URL: https://datasheet.ciiva.com/29699/inductor-commercial-decoupling-mlz-en-29699062.pdf?src-supplier=Digi-Key; ComponentLink2Description: https://datasheet.ciiva.com/29699/inductor-commercial-decoupling-mlz-en-29699062.pdf?src-supplier=Digi-Key; ComponentLink3URL: https://datasheet.ciiva.com/29699/inductor-commercial-decoupling-mlz-en-29699063.pdf?src-supplier=Digi-Key; ComponentLink3Description: https://datasheet.ciiva.com/29699/inductor-commercial-decoupling-mlz-en-29699063.pdf?src-supplier=Digi-Key
LED4 = 150141M173100: Standard LEDs - SMD WL-SFTW SMDBiClr Top WL-SFTW; Manufacturer: Wurth Electronics; Color: Blue,Green,Red; Viewing Angle: 120°; Lens Style: Clear,Round; Wavelength: 470nm; Forward Current: 30mA; Luminous Intensity: 230mcd; Test Current: 20mA; Forward Voltage: 3.2V; Supplier 1: Digi-Key; RoHS: Yes; Category: LEDs; Stock 1: 32966; Mount: Surface Mount; Case/Package: 1411; Number of Pins: 4; Case Code (Metric): 3528; Case Code (Imperial): 1411; Min Operating Temperature: -40°C; Max Operating Temperature: 85°C; Package Quantity: 2000; Packaging: Tape and Reel; Dominant Wavelength: 470nm; Length: 3.5mm; Width: 2.8mm; Height: 1.9mm; REACH SVHC: Unknown; RoHS Compliant: Yes; ComponentLink1URL: https://datasheet.ciiva.com/29562/150141m173100-29562961.pdf?src-supplier=Digi-Key; ComponentLink1Description: https://datasheet.ciiva.com/29562/150141m173100-29562961.pdf?src-supplier=Digi-Key; ComponentLink2URL: https://datasheet.ciiva.com/29278/759471-da-01-en-smd-topled-rgb-150141m173100-29278963.pdf?src-supplier=Conrad; ComponentLink2Description: https://datasheet.ciiva.com/29278/759471-da-01-en-smd-topled-rgb-150141m173100-29278963.pdf?src-supplier=Conrad; ComponentLink3URL: https://datasheet.ciiva.com/22653/1911491-22653029.pdf?src-supplier=Element14; ComponentLink3Description: https://datasheet.ciiva.com/22653/1911491-22653029.pdf?src-supplier=Element14; Supplier Part Number 1: 732-4998-1-ND; Manufacturer Part Number: 150141M173100; Pricing 1: 1=0,47000, 50=0,45900, 100=0,40000, 500=0,33300 (USD); Link: https://www.digikey.com/en/products/detail/w%C3%BCrth-elektronik/150141M173100/4489960?s=N4IgTCBcDaIIwFYAMcAscCycDsBmOSSIAugL5A
P4-P6 = Header 2x1: Connector Header Through Hole 2 position 0.100" (2.54mm); Manufacturer: Amphenol FCI; Manufacturer Part Number: 68001-402HLF; Number of Contacts: 2; Connector Type: Male Pin; Insulation Resistance: 5GR; Max Voltage Rating (AC): 1.5kV; Gender: Male; Current Rating: 3A; Contact Post Length: 3.05mm; Link: https://www.digikey.com/product-detail/en/amphenol-icc-fci/68001-402HLF/609-3507-ND/1530472; Supplier 1: Digi-Key; Supplier Part Number 1: 609-3507-ND; RoHS: Yes; Category: Headers and Wire Housings; Stock 1: 5598; Pricing 1: 1=0,12000, 10=0,11600, 100=0,07160, 500=0,05928, 1000=0,05187, 5000=0,04446, 10000=0,04323 (USD); Mount: Through Hole; Contact Plating: Tin; Housing Material: Thermoplastic; Housing Color: Black; Color: Black; Contact Material: Bronze; Min Operating Temperature: -65°C; Max Operating Temperature: 125°C; Termination: Solder; Number of Rows: 1; Number of Positions: 2; Orientation: Straight; Package Quantity: 100; Packaging: Bulk; Contact Gender: Male; Voltage Rating: 1.5kV; Length: 5.08mm; Pitch: 2.54mm; Contact Mating Length: 0.23inch; Depth: 2.41mm; Radiation Hardening: No; REACH SVHC: No SVHC; Flammability Rating: UL94 V-0; Lead Free: Lead Free; ComponentLink1URL: https://datasheet.ciiva.com/724/68000-724389.pdf?src-supplier=Digi-Key; ComponentLink1Description: https://datasheet.ciiva.com/724/68000-724389.pdf?src-supplier=Digi-Key; ComponentLink2URL: https://datasheet.ciiva.com/16726/68000-16726185.pdf?src-supplier=Avnet+Europe; ComponentLink2Description: https://datasheet.ciiva.com/16726/68000-16726185.pdf?src-supplier=Avnet+Europe; ComponentLink3URL: https://datasheet.ciiva.com/10149/68000-10149338.pdf?src-supplier=Avnet; ComponentLink3Description: https://datasheet.ciiva.com/10149/68000-10149338.pdf?src-supplier=Avnet; ComponentLink4URL: https://datasheet.ciiva.com/46385/1748756-46385306.pdf?src-supplier=Element14; ComponentLink4Description: https://datasheet.ciiva.com/46385/1748756-46385306.pdf?src-supplier=Element14
R11-R13 = Resistor: RES 10K OHM 1% 1/4W 0805; Manufacturer: Stackpole Electronics; Manufacturer Part Number: RNCP0805FTD10K0; Max Power Dissipation: 250mW; Temperature Coefficient: 100ppm/°C; Link: https://www.digikey.com/en/products/detail/stackpole-electronics-inc/RNCP0805FTD10K0/2240262; Supplier 1: Digi-Key; Supplier Part Number 1: RNCP0805FTD10K0CT-ND; RoHS: Yes; Category: Chip SMD Resistors; Stock 1: 271706; Pricing 1: 1=0,10000, 10=0,07300, 100=0,02970, 1000=0,01336, 2500=0,01159 (USD); Mount: Surface Mount; Case/Package: 0805; Case Code (Metric): 2012; Case Code (Imperial): 0805; Min Operating Temperature: -55°C; Max Operating Temperature: 155°C; Resistance: 10kR; Tolerance: 1%; Packaging: Tape and Reel; Resistor Type: Thin Film; Number of Terminations: 2; Features: Moisture Resistant,Anti-Sulfur; Series: RNCP; Length: 0.079inch; Width: 0.049inch; Height: 0.024inch; Lead Free: Lead Free; RoHS Compliant: Yes; ComponentLink1URL: https://www.seielect.com/catalog/SEI-Packaging.pdf?src-supplier=Digi-Key; ComponentLink1Description: https://www.seielect.com/catalog/SEI-Packaging.pdf?src-supplier=Digi-Key
R14 R15 = Resistor: Res Thick Film 0805 2.2K Ohm 5% 1/8W ±200ppm/°C Molded SMD SMD Paper T/R; Manufacturer: Vishay Dale; Manufacturer Part Number: CRCW08052K20JNEA; Power Rating: 125mW; Voltage Rating: 150V; Link: https://www.digikey.com/es/products/detail/CRCW08052K20JNEAC/541-4169-1-ND/7928852?utm_campaign=buynow&utm_medium=aggregator&curr=usd&utm_source=octopart; Supplier 1: Digi-Key; Supplier Part Number 1: 541-2.2KACT-ND; RoHS: Yes; Category: Chip SMD Resistors; Stock 1: 1572; Pricing 1: 1=0,10000, 10=0,04200, 100=0,01700, 1000=0,00762, 2500=0,00661 (USD); Case/Package: 0805; Weight: 0.000194oz; Case Code (Imperial): 0805; Case Code (Metric): 2012; Contact Plating: Tin; Min Operating Temperature: -55°C; Max Operating Temperature: 155°C; Resistance: 2.2kR; Tolerance: 5%; Packaging: Tape and Reel; Package Quantity: 5000; Termination: SMD/SMT; Resistor Type: Thick Film; Temperature Coefficient: 200ppm/°C; Voltage Rating (DC): 150V; Working Voltage: 150V; Number of Terminations: 2; Features: Automotive AEC-Q200; Series: CRCW; Max Power Dissipation: 125mW; Construction: Rectangular; Technology: THICK FILM; Resistance Tolerance: 5%; Length: 2mm; Width: 1.25mm; Height: 0.45mm; Depth: 1.25mm; Radiation Hardening: No; Lead Free: Lead Free; RoHS Compliant: Yes; REACH SVHC: Unknown; Military Standard: Not; ComponentLink1URL: https://datasheet.ciiva.com/5552/dcrcwe3-109170-5552443.pdf?src-supplier=Mouser; ComponentLink1Description: https://datasheet.ciiva.com/5552/dcrcwe3-109170-5552443.pdf?src-supplier=Mouser; ComponentLink2URL: https://datasheet.ciiva.com/16199/dcrcwe3-16199755.pdf?src-supplier=Future+Electronics; ComponentLink2Description: https://datasheet.ciiva.com/16199/dcrcwe3-16199755.pdf?src-supplier=Future+Electronics; ComponentLink3URL: https://datasheet.ciiva.com/16723/70201119-16723963.pdf?src-supplier=Allied+Electronics; ComponentLink3Description: https://datasheet.ciiva.com/16723/70201119-16723963.pdf?src-supplier=Allied+Electronics
R18 = Resistor: YAGEO         RC0805FR-07100KL            RES, THICK FILM, 100K, 1%, 0.125W, 0805, REEL; Temperature Coefficient: 100ppm/°C; Power Rating: 125mW; Voltage Rating (DC): 150V; Link: https://www.digikey.com/products/en/resistors/chip-resistor-surface-mount/52?k=RC0805FR-07100KL&k=&pkeyword=RC0805FR-07100KL&sv=0&pv7=2&sf=0&quantity=&ColumnSort=0&page=1&pageSize=25; Supplier 1: Digi-Key; Supplier Part Number 1: 311-100KCRCT-ND; Manufacturer: Yageo; Manufacturer Part Number: RC0805FR-07100KL; RoHS: Yes; Category: Chip SMD Resistors; Stock 1: 4114962; Pricing 1: 1=0,10000, 10=0,04000, 100=0,01630, 1000=0,00731, 2500=0,00635 (USD); Case/Package: 0805; Number of Pins: 2; Case Code (Metric): 2012; Case Code (Imperial): 0805; Min Operating Temperature: -55°C; Max Operating Temperature: 155°C; Composition: Thick Film; Tolerance: 1%; Resistance: 100kR; Packaging: Tape and Reel; Voltage Rating: 150V; Package Quantity: 1; Number of Terminations: 2; Termination: SMD/SMT; Military Standard: Not; Max Power Dissipation: 125mW; Features: Moisture Resistant; Length: 2mm; Height: 0.024inch; Width: 0.049inch; Depth: 1.25mm; Lead Pitch: 0.4mm; REACH SVHC: Unknown; Lead Free: Lead Free; ComponentLink1URL: https://datasheet.ciiva.com/11808/0900766b8106beab-11808858.pdf?src-supplier=RSComponents; ComponentLink1Description: https://datasheet.ciiva.com/11808/0900766b8106beab-11808858.pdf?src-supplier=RSComponents; ComponentLink2URL: https://datasheet.ciiva.com/2457/pyu-r-int-thick-7-2457017.pdf?src-supplier=Digi-Key; ComponentLink2Description: https://datasheet.ciiva.com/2457/pyu-r-int-thick-7-2457017.pdf?src-supplier=Digi-Key; ComponentLink3URL: https://datasheet.ciiva.com/12667/rc0805-12667001.pdf?src-supplier=Mouser; ComponentLink3Description: https://datasheet.ciiva.com/12667/rc0805-12667001.pdf?src-supplier=Mouser; ComponentLink4URL: https://datasheet.ciiva.com/2457/pyu-r-int-thick-7-2457018.pdf?src-supplier=Digi-Key; ComponentLink4Description: https://datasheet.ciiva.com/2457/pyu-r-int-thick-7-2457018.pdf?src-supplier=Digi-Key; ComponentLink5URL: https://datasheet.ciiva.com/16747/rc0805-16747226.pdf?src-supplier=Future+Electronics; ComponentLink5Description: https://datasheet.ciiva.com/16747/rc0805-16747226.pdf?src-supplier=Future+Electronics; ComponentLink6URL: https://datasheet.ciiva.com/2457/pyu-r-int-thick-7-2457019.pdf?src-supplier=Digi-Key; ComponentLink6Description: https://datasheet.ciiva.com/2457/pyu-r-int-thick-7-2457019.pdf?src-supplier=Digi-Key; ComponentLink7URL: https://datasheet.ciiva.com/7660/38627-7660796.pdf?src-supplier=Element14; ComponentLink7Description: https://datasheet.ciiva.com/7660/38627-7660796.pdf?src-supplier=Element14; ComponentLink8URL: https://datasheet.ciiva.com/7941/1697719-7941676.pdf?src-supplier=Element14; ComponentLink8Description: https://datasheet.ciiva.com/7941/1697719-7941676.pdf?src-supplier=Element14; ComponentLink9URL: https://datasheet.ciiva.com/7941/1686128-7941677.pdf?src-supplier=Element14; ComponentLink9Description: https://datasheet.ciiva.com/7941/1686128-7941677.pdf?src-supplier=Element14; ComponentLink10URL: https://datasheet.ciiva.com/7941/1697719-7941678.pdf?src-supplier=Element14; ComponentLink10Description: https://datasheet.ciiva.com/7941/1697719-7941678.pdf?src-supplier=Element14; ComponentLink11URL: https://datasheet.ciiva.com/22747/444164-22747534.pdf?src-supplier=Element14; ComponentLink11Description: https://datasheet.ciiva.com/22747/444164-22747534.pdf?src-supplier=Element14
R19 = Resistor: YAGEO - RC0805JR-074K7L. - RES, THICK FILM, 4K7, 5%, 0.125W, 0805; Temperature Coefficient: 100ppm/°C; Power Rating: 125mW; Voltage Rating: 150V; Link: https://www.digikey.com/es/products/detail/yageo/RC0805JR-074K7L/728327?s=N4IgTCBcDaIEoGEAMAOJBWAUnAtEg7ACwDS%2BAMiALoC%2BQA; Supplier 1: Arrow Electronics; Supplier Part Number 1: RC0805JR-074K7L; Manufacturer: Yageo; Manufacturer Part Number: RC0805JR-074K7L; RoHS: Yes; Category: Chip SMD Resistors; Stock 1: 19425000; Pricing 1: 5000=0,00520, 10000=0,00490, 25000=0,00320, 5000=0,00580, 50000=0,00540, 500000=0,00300, 2500000=0,00190 (USD); Case/Package: 0805; Contact Plating: Tin,Lead,Matte; Case Code (Imperial): 0805; Case Code (Metric): 2012; Size Code: 0805; Min Operating Temperature: -55°C; Max Operating Temperature: 155°C; Resistance: 4.7kR; Tolerance: 5%; Resistor Type: Thick Film; Packaging: Tape and Reel; Termination: SMD/SMT; Features: Moisture Resistant; Series: RC; Max Power Dissipation: 125mW; Number of Terminations: 2; Resistance Tolerance: 5%; Construction: Rectangular; Length: 2mm; Depth: 1.25mm; Radiation Hardening: No; REACH SVHC: Unknown; Lead Free: Lead Free; Military Standard: Not; RoHS Compliant: Yes; ComponentLink1URL: https://datasheet.ciiva.com/12667/rc0805-12667037.pdf?src-supplier=Mouser; ComponentLink1Description: https://datasheet.ciiva.com/12667/rc0805-12667037.pdf?src-supplier=Mouser; ComponentLink2URL: https://datasheet.ciiva.com/17486/rc0805-17486827.pdf?src-supplier=Future+Electronics; ComponentLink2Description: https://datasheet.ciiva.com/17486/rc0805-17486827.pdf?src-supplier=Future+Electronics; ComponentLink3URL: https://datasheet.ciiva.com/7941/442941-7941973.pdf?src-supplier=Element14; ComponentLink3Description: https://datasheet.ciiva.com/7941/442941-7941973.pdf?src-supplier=Element14; ComponentLink4URL: https://datasheet.ciiva.com/7941/442941-7941974.pdf?src-supplier=Element14; ComponentLink4Description: https://datasheet.ciiva.com/7941/442941-7941974.pdf?src-supplier=Element14
R20 = Resistor: RES TF 1/8W 330 OHM 5% 0805; Manufacturer: Stackpole Electronics; Manufacturer Part Number: RMCF0805JT330R; Power Rating: 125mW; Temperature Coefficient: 200ppm/°C; Link: https://www.digikey.com/es/products/detail/stackpole-electronics-inc/RMCF0805JT330R/1757830?s=N4IgTCBcDaIEoFkDCAxADADjQVgFIBUBmQtOEAXQF8g; Supplier 1: Digi-Key; Supplier Part Number 1: RMCF0805JT330RCT-ND; RoHS: Yes; Category: Chip SMD Resistors; Stock 1: 29700; Pricing 1: 1=0,10000, 10=0,02000, 100=0,00810, 1000=0,00366, 2500=0,00318 (USD); Mount: Surface Mount; Case/Package: 0805; Case Code (Metric): 2012; Case Code (Imperial): 0805; Contact Plating: Tin,Matte; Size Code: 0805; Min Operating Temperature: -55°C; Max Operating Temperature: 155°C; Packaging: Tape and Reel; Resistance: 330R; Tolerance: 5%; Resistor Type: Thick Film; Number of Terminations: 2; Max Power Dissipation: 125mW; Features: Automotive AEC-Q200; Series: RMCF; Construction: Rectangular; Length: 2mm; Width: 0.049inch; Height: 0.026inch; Depth: 1.25mm; Radiation Hardening: No; Military Standard: Not; Lead Free: Lead Free; RoHS Compliant: Yes; ComponentLink1URL: http://components.arrow.com/part/dataview/44988371S7054774N1174?src-supplier=Arrow+Electronics; ComponentLink1Description: http://components.arrow.com/part/dataview/44988371S7054774N1174?src-supplier=Arrow+Electronics; ComponentLink2URL: https://www.seielect.com/catalog/SEI-Packaging.pdf?src-supplier=Digi-Key; ComponentLink2Description: https://www.seielect.com/catalog/SEI-Packaging.pdf?src-supplier=Digi-Key; ComponentLink3URL: https://www.seielect.com/Catalog/SEI-RMCF_RMCP.pdf?src-supplier=Avnet; ComponentLink3Description: https://www.seielect.com/Catalog/SEI-RMCF_RMCP.pdf?src-supplier=Avnet; ComponentLink4URL: https://www.verical.com/server-webapp/html/getDatasheet?partID=360139&src-supplier=Verical; ComponentLink4Description: https://www.verical.com/server-webapp/html/getDatasheet?partID=360139&src-supplier=Verical; ComponentLink5URL: http://www.seielect.com/Catalog/SEI-RMC.pdf?src-supplier=Future+Electronics; ComponentLink5Description: http://www.seielect.com/Catalog/SEI-RMC.pdf?src-supplier=Future+Electronics
R21 = Resistor: Res Thick Film 0805 30K Ohm 1% 0.125W(1/8W) ±100ppm/C Epoxy SMD T/R; Manufacturer: Yageo; Manufacturer Part Number: RC0805FR-0730KL; Voltage Rating (DC): 150V; Temperature Coefficient: 100ppm/°C; Power Rating: 125mW; Link: https://www.digikey.com/product-detail/en/yageo/RC0805FR-0730KL/311-30-0KCRCT-ND/730790; Supplier 1: Digi-Key; Supplier Part Number 1: 311-30.0KCRCT-ND; RoHS: Yes; Category: Chip SMD Resistors; Stock 1: 237980; Pricing 1: 1=0,10000, 10=0,04000, 100=0,01630, 1000=0,00731, 2500=0,00635 (USD); Mount: Surface Mount; Case/Package: 0805; Case Code (Metric): 2012; Case Code (Imperial): 0805; Min Operating Temperature: -55°C; Max Operating Temperature: 155°C; Resistance: 30kR; Tolerance: 1%; Packaging: Tape and Reel; Features: Moisture Resistant; Composition: Thick Film; Number of Terminations: 2; Termination: SMD/SMT; Max Power Dissipation: 125mW; Military Standard: Not; Working Voltage: 150V; Package Quantity: 1; Voltage Rating: 150V; Length: 0.079inch; Height: 0.024inch; Depth: 1.25mm; Width: 0.049inch; Lead Free: Lead Free; ComponentLink1URL: https://datasheet.ciiva.com/2519/pyu-r-int-thick-7-2519684.pdf?src-supplier=Digi-Key; ComponentLink1Description: https://datasheet.ciiva.com/2519/pyu-r-int-thick-7-2519684.pdf?src-supplier=Digi-Key; ComponentLink2URL: https://datasheet.ciiva.com/2519/pyu-r-int-thick-7-2519685.pdf?src-supplier=Digi-Key; ComponentLink2Description: https://datasheet.ciiva.com/2519/pyu-r-int-thick-7-2519685.pdf?src-supplier=Digi-Key; ComponentLink3URL: https://datasheet.ciiva.com/12668/rc0805-12668181.pdf?src-supplier=Mouser; ComponentLink3Description: https://datasheet.ciiva.com/12668/rc0805-12668181.pdf?src-supplier=Mouser; ComponentLink4URL: https://datasheet.ciiva.com/2519/pyu-r-int-thick-7-2519686.pdf?src-supplier=Digi-Key; ComponentLink4Description: https://datasheet.ciiva.com/2519/pyu-r-int-thick-7-2519686.pdf?src-supplier=Digi-Key; ComponentLink5URL: https://datasheet.ciiva.com/15189/getdatasheetpartid-329356-15189948.pdf?src-supplier=Verical; ComponentLink5Description: https://datasheet.ciiva.com/15189/getdatasheetpartid-329356-15189948.pdf?src-supplier=Verical
SW1 = Switch: Switch Tactile N.O. SPST Round Button Gull Wing 0.05A 12VDC 100000Cycles 2.45N SMD T/R; Manufacturer: ITT C&K; Manufacturer Part Number: PTS647SK38SMTR2LFS; Illumination Type: Non-Illuminated; Switch Function: Off-Mom; Actuator Type: Standard; Operating Force: 250gf; Switch Travel: 0.25mm; Ratings: IP40; Link: https://www.digikey.com/product-detail/en/c-k/PTS-647-SK38-SMTR2-LFS/PTS647SK38SMTR2LFSCT-ND/9649871; Supplier 1: Digi-Key; Supplier Part Number 1: PTS647SK38SMTR2LFSCT-ND; RoHS: No; Category: Tactile Switches; Stock 1: 18941; Pricing 1: 1=0,13000, 10=0,12700, 25=0,12080, 100=0,10970, 250=0,10308, 500=0,09432, 1000=0,07897 (USD); Mount: Surface Mount; Mechanical Life: 100000Cycles; Min Operating Temperature: -20°C; Max Operating Temperature: 70°C; Throw Configuration: SPST; Packaging: Tape and Reel; Termination: Gull Wing; ComponentLink1URL: https://www.ckswitches.com/media/2567/pts647.pdf?src-supplier=Digi-Key; ComponentLink1Description: https://www.ckswitches.com/media/2567/pts647.pdf?src-supplier=Digi-Key
U4 = TPL5010-Q1: IC TIMER W/WATCHDOG 6-SOT; Manufacturer: Texas Instruments; Manufacturer Part Number: TPL5010QDDCTQ1; Quiescent Current: 35nA; Number of Timers/Counters: 1; Low Level Output Current: 1mA; High Level Output Current: -1mA; Supplier 1: Digi-Key; RoHS: Yes; Category: Clock and Timing; Stock 1: 146933; Pricing 1: 1=0,89000, 10=0,78500, 25=0,73800, 100=0,55930, 250=0,47600, 500=0,45220, 1000=0,34510 (USD); Mount: Surface Mount; Case/Package: SOT-23-6; Number of Pins: 6; Weight: 0.00127oz; Contact Plating: Gold; Min Operating Temperature: -40°C; Max Operating Temperature: 105°C; Packaging: Tape and Reel; Package Quantity: 3000; Lead Free: Lead Free; ComponentLink1URL: http://www.ti.com/lit/gpn/TPL5010?src-supplier=Mouser; ComponentLink1Description: http://www.ti.com/lit/gpn/TPL5010?src-supplier=Mouser; ComponentLink2URL: http://www.ti.com/general/docs/lit/getliterature.tsp?genericPartNumber=TPL5010&&fileType=pdf&src-supplier=Avnet+Asia; ComponentLink2Description: http://www.ti.com/general/docs/lit/getliterature.tsp?genericPartNumber=TPL5010&&fileType=pdf&src-supplier=Avnet+Asia; ComponentLink3URL: http://www.ti.com/lit/ds/symlink/tpl5010.pdf?src-supplier=Digi-Key; ComponentLink3Description: http://www.ti.com/lit/ds/symlink/tpl5010.pdf?src-supplier=Digi-Key; ComponentLink4URL: http://www.ti.com/general/docs/lit/getliterature.tsp?genericPartNumber=TPL5010&&fileType=pdf&src-supplier=Avnet; ComponentLink4Description: http://www.ti.com/general/docs/lit/getliterature.tsp?genericPartNumber=TPL5010&&fileType=pdf&src-supplier=Avnet; Link: https://www.digikey.com/product-detail/en/texas-instruments/TPL5010QDDCTQ1/296-44929-1-ND/6227376; Supplier Part Number 1: 296-44392-1-ND
U6 = ATSAMD21G18A-AU: CORTEX-M0+, 256KB Flash, 32KB SRAM, Usb, Dma, T&r - 48TQFP Ind Temp, Green, 1.6-3.6V, 48MHZ; Manufacturer: Microchip / Atmel; Interface: I2C,SPI,UART,USART,LIN,USB,I2S; Number of I/Os: 38; Oscillator Type: Internal; Peripherals: Brown-out Detect/Reset,POR,PWM,WDT,DMA; Core Architecture: ARM; Number of Timers/Counters: 6; Min Supply Voltage: 1.62V; Max Supply Voltage: 3.63V; Data Bus Width: 32b; Watchdog Timer: Yes; Operating Supply Voltage: 3.3V; Supplier 1: Arrow Electronics; RoHS: Yes; Category: Microcontrollers; Mount: Surface Mount; Case/Package: TQFP; Number of Pins: 48; Contact Plating: Tin,Matte; Min Operating Temperature: -40°C; Max Operating Temperature: 85°C; Packaging: Tray; Frequency: 48MHz; Memory Type: FLASH; Memory Size: 256KB; RAM Size: 32KB; Number of Programmable I/O: 38; Max Frequency: 48MHz; RoHS Compliant: Yes; REACH SVHC: No SVHC; Lead Free: Lead Free; ComponentLink1URL: https://datasheet.ciiva.com/46427/1807566-46427631.pdf?src-supplier=Element14; ComponentLink1Description: https://datasheet.ciiva.com/46427/1807566-46427631.pdf?src-supplier=Element14; Link: https://www.digikey.com/en/products/detail/microchip-technology/ATSAMD21G18A-AU/5056473; Supplier Part Number 1: ATSAMD21G18A-AU; Manufacturer Part Number: ATSAMD21G18A-AU